# EAGLE design LEDDriver_v_6 (EAGLE 6.5.0)
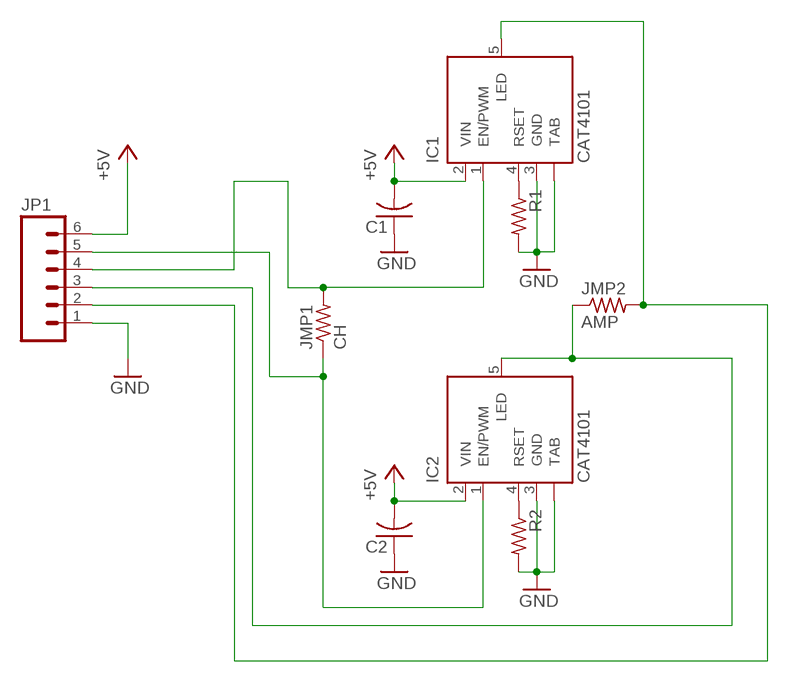
[diagram p0: schematic, sheet 1]

## Parts
C1  C-USC1206  [C1206]
C2  C-USC1206  [C1206]
IC1  CAT4101  [TO263_5]
IC2  CAT4101  [TO263_5]
JMP1  CH  R-US_R1206  [R1206]
JMP2  AMP  R-US_R1206  [R1206]
JP1  M06LOCK_LONGPADS  [1X06_LOCK_LONGPADS]
R1  R-US_R1206  [R1206]
R2  R-US_R1206  [R1206]

## Nets
+5V: C1.2 C2.2 IC1.2(VIN) IC2.2(VIN) JP1.6
GND: C1.1 C2.1 IC1.3(GND) IC1.TAB IC2.3(GND) IC2.TAB JP1.1 R1.2 R2.2
N$1: IC1.1(EN/PWM) JMP1.2 JP1.4
N$2: IC2.1(EN/PWM) JMP1.1 JP1.5
N$3: IC1.4(RSET) R1.1
N$4: IC2.5(LED) JMP2.1 JP1.3
N$5: IC1.5(LED) JMP2.2 JP1.2
N$8: IC2.4(RSET) R2.1

## Library data of the parts
C1 C2 = adafruit:C-US: CAPACITOR, American symbol
IC1 IC2 = on-semiconductor:CAT4101: 1A Constant-Current LED Driver with PWM Dimming Source: ON Semiconductor .. 4101.pdf; MPN: CAT4101TV-T75; OC_FARNELL: 1718452; OC_NEWARK: 08R5264
JMP1 JMP2 R1 R2 = adafruit:R-US_: RESISTOR, American symbol
JP1 = SparkFun-Connectors:M06: Header 6 Standard 6-pin 0.1" header. Use with straight break away headers (SKU : PRT-00116), right angle break away headers (PRT-00553), swiss pins (PRT-00743), machine pins (PRT-00117), and female headers (PRT-00115). Molex polarized connector foot print use with SKU : PRT-08094 with associated crimp pins and housings. NOTES ON THE VARIANTS LOCK and LOCK_LONGPADS... This footprint was designed to help hold the alignment of a through-hole component (i.e. 6-pin header) while soldering it into place. You may notice that each hole has been shifted either up or down by 0.005 of an inch from it's more standard position (which is a perfectly straight line). This slight alteration caused the pins (the squares in the middle) to touch the edges of the holes. Because they are alternating, it causes a "brace" to hold the component in place. 0.005 has proven to be the perfect amount of "off-center" position when using our standard breakaway headers. Although looks a little odd when you look at the bare footprint, once you have a header in there, the alteration is very hard to notice. Also,if you push a header all the way into place, it is covered up entirely on the bottom side. This idea of altering the position of holes to aid alignment will be further integrated into the Sparkfun Library for other footprints. It can help hold any component with 3 or more connection pins.

## Net classes
0 default: width 0.203 mm, drill 0.152 mm, clearance 0.203 mm

## Board
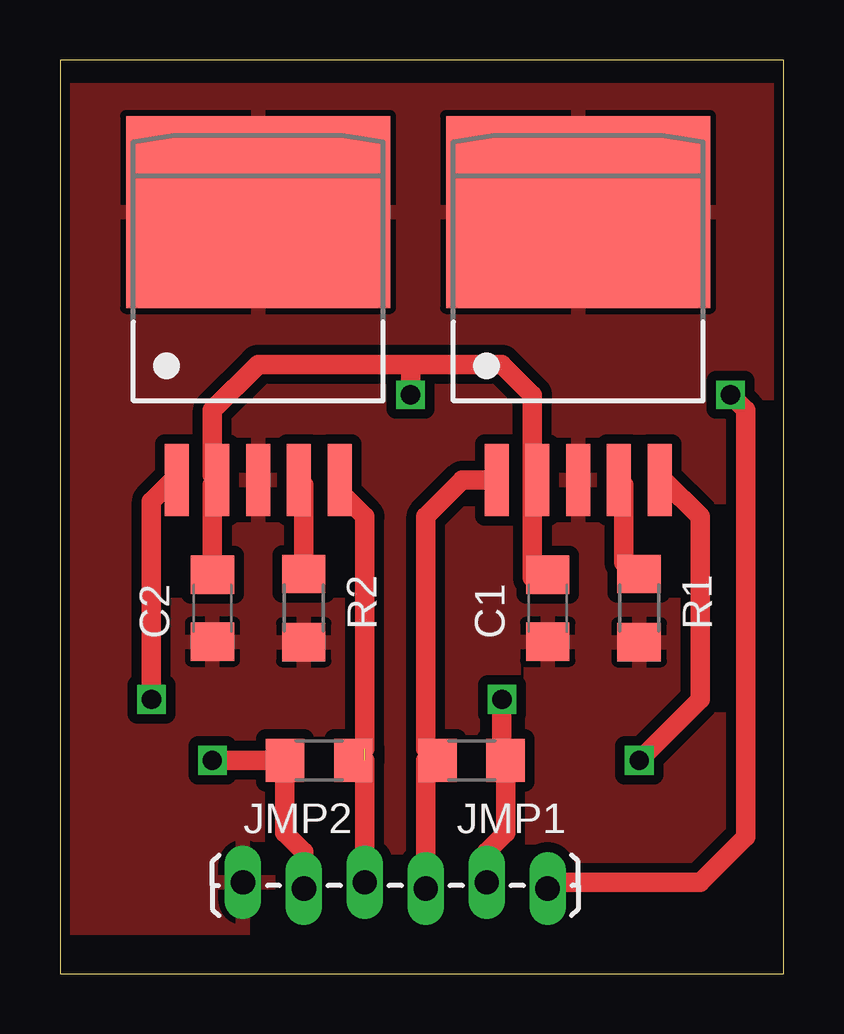
[diagram p1: board, top side]
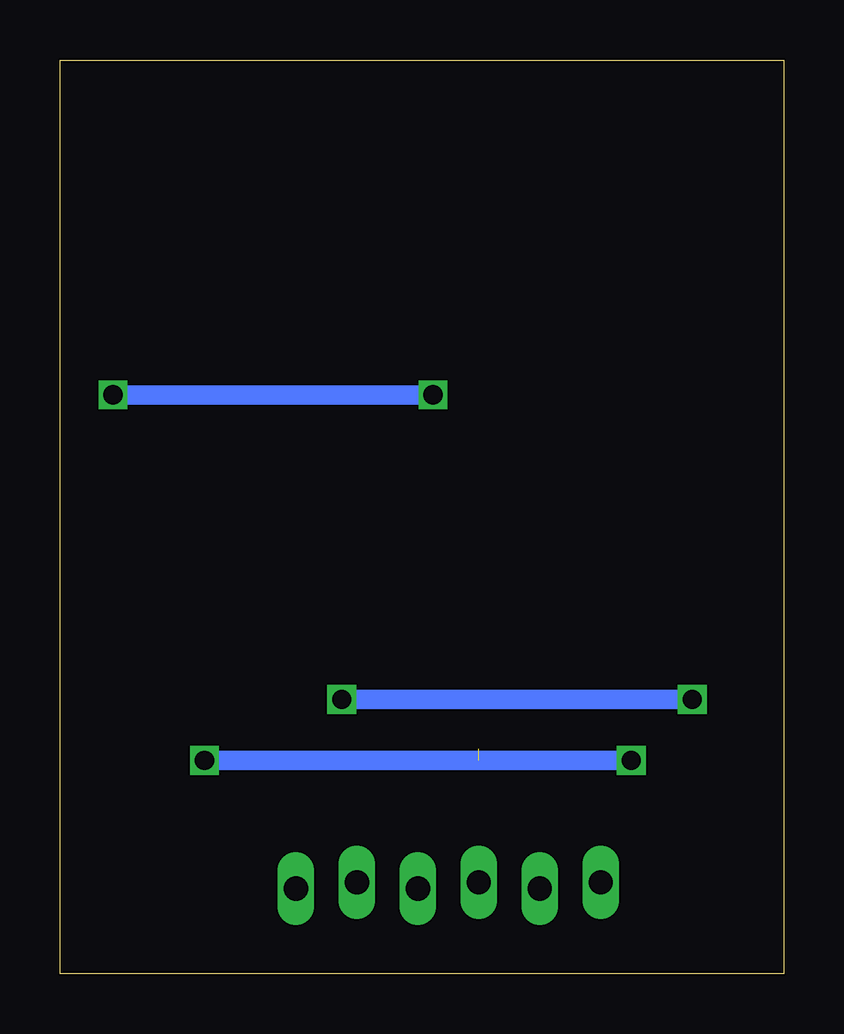
[diagram p2: board, bottom side, seen from below]

Size 30.15 x 38.09 mm. Coordinates in mm from the lower left corner, seen from the top.
Outline: 0,0 30.15,0 30.15,38.09 0,38.09 0,0
Copper layers (1*16): Top 0.035mm / dielectric 1.5mm / Bottom 0.035mm
Design rules "ITEADstudio_DRC": minimum track width 6mil, minimum drill 12mil, track to track 6mil, track to pad 6mil, pad to pad 6mil, via to via 6mil, smd to smd 0mil, copper to edge 10mil, drill to drill 10mil, minimum pad ring 10mil, minimum via ring 6mil, stop-mask expansion 2mil, vias tented up to drill 100mil, thermal gap 10mil

### Footprints (pad centres in the part's own frame; a part is rotated, then mirrored left to right if it is on the bottom)
C1206 = smd 1.6 x 1.8: 1 -1.4,0; 2 1.4,0
TO263_5 = smd 1 x 3: 1 -3.4,-8; 2 -1.7,-8; 3 0,-8; 4 1.7,-8; 5 3.4,-8 | smd 11 x 8: TAB 0,3.175
R1206 = smd 1.6 x 1.803: 1 -1.422,0; 2 1.422,0
1X06_LOCK_LONGPADS = drill 1.016 long: 1 0,0; 2 2.54,-0.254; 3 5.08,0; 4 7.62,-0.254; 5 10.16,0; 6 12.7,-0.254

### Placement (x,y rotation side)
C1  20.32,15.24 90 top
C2  6.35,15.24 90 top
IC1  21.59,28.57 0 top
IC2  8.26,28.57 0 top
JMP1  17.14,8.89 180 top
JMP2  10.79,8.89 180 top
JP1  7.62,3.81 0 top
R1  24.13,15.24 270 top
R2  10.16,15.24 270 top

### Tracks (layer width: path | path; a pad name or v marks a point on that pad's centre or on a via)
+5V  (via drill 0.8)
  Top 0.813: C2.2 6.35,20.37 IC2.2 6.35,20.78 6.35,23.5 8.26,25.4 14.61,25.4 | IC1.2 19.68,20.37 | 19.68,20.37 19.68,16.51 19.82,16.64 C1.2 | JP1.6 20.57,3.81 26.67,3.81 28.57,5.71 28.57,23.5 v27.94,24.13 | 19.68,20.37 19.68,24.13 18.41,25.4 14.61,25.4 | v14.61,24.13 14.61,25.4
  Bottom 0.813: v27.94,24.13 v14.61,24.13
GND
  pour Top (isolate 0.406): 0,36.83 29.84,36.83 29.84,1.91 0,1.91
N$1
  Top 0.813: JP1.4 15.24,8.89 JMP1.2 15.24,9.37 15.24,19.05 16.77,20.57 IC1.1
N$2  (via drill 0.8)
  Top 0.813: JP1.5 17.78,5.08 18.57,5.87 JMP1.1 18.41,9.04 v18.41,11.43 | v3.81,11.43 3.81,19.68 4.7,20.57 IC2.1
  Bottom 0.813: v18.41,11.43 v3.81,11.43
N$3
  Top 0.813: IC1.4 23.5,20.37 23.5,17.14 23.98,16.66 R1.1
N$4  (1 unrouted)
  Top 0.813: JP1.3 12.7,8.89 | JMP2.1 12.7,9.37 12.7,19.05 11.65,20.09 IC2.5
N$5  (via drill 0.8)
  Top 0.813: JP1.2 10.16,5.08 9.37,5.87 JMP2.2 v6.35,8.89 | v24.13,8.89 26.67,11.43 26.67,19.05 25.14,20.57 IC1.5
  Bottom 0.813: v6.35,8.89 v24.13,8.89
N$8
  Top 0.813: R2.1 10.16,20.37 IC2.4